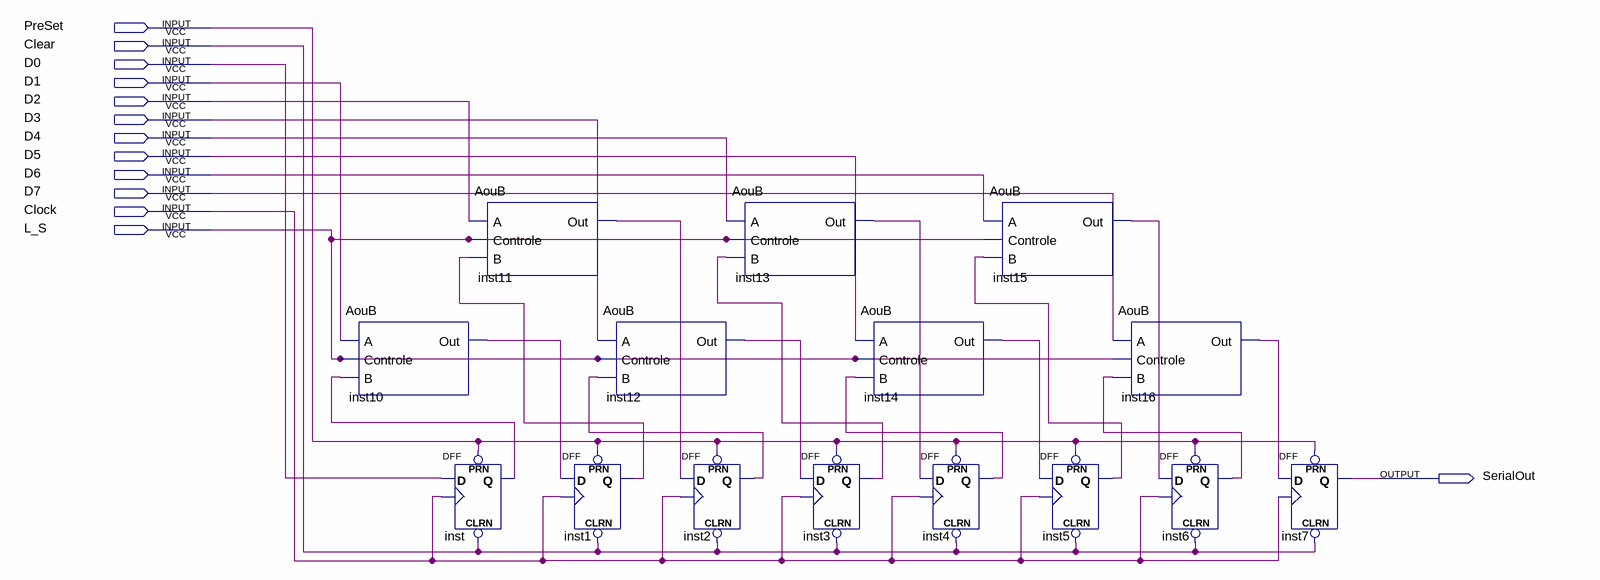
[diagram p0: schematic sheet]
// Quartus schematic PISO8.bdf as structural Verilog: 15 symbols, 13 pins
module PISO8 (
  input  PreSet,
  input  Clear,
  input  D0,
  input  D1,
  input  D2,
  input  D3,
  input  D4,
  input  D5,
  input  D6,
  input  D7,
  input  Clock,
  input  L_S,
  output SerialOut
);

  wire inst1_q, inst2_q, inst3_q, inst4_q, inst5_q, inst6_q, inst10_out, inst11_out, inst12_out, inst13_out,
       inst14_out, inst15_out, inst16_out, inst_q;

  AouB inst10 (.A(D1), .Controle(L_S), .B(inst_q), .Out(inst10_out));
  AouB inst11 (.A(D2), .Controle(L_S), .B(inst1_q), .Out(inst11_out));
  DFF inst (.CLRN(Clear), .CLK(Clock), .D(D0), .PRN(PreSet), .Q(inst_q));
  DFF inst1 (.CLRN(Clear), .CLK(Clock), .D(inst10_out), .PRN(PreSet), .Q(inst1_q));
  AouB inst12 (.A(D3), .Controle(L_S), .B(inst2_q), .Out(inst12_out));
  AouB inst13 (.A(D4), .Controle(L_S), .B(inst3_q), .Out(inst13_out));
  DFF inst2 (.CLRN(Clear), .CLK(Clock), .D(inst11_out), .PRN(PreSet), .Q(inst2_q));
  DFF inst3 (.CLRN(Clear), .CLK(Clock), .D(inst12_out), .PRN(PreSet), .Q(inst3_q));
  AouB inst14 (.A(D5), .Controle(L_S), .B(inst4_q), .Out(inst14_out));
  DFF inst4 (.CLRN(Clear), .CLK(Clock), .D(inst13_out), .PRN(PreSet), .Q(inst4_q));
  AouB inst15 (.A(D6), .Controle(L_S), .B(inst5_q), .Out(inst15_out));
  DFF inst5 (.CLRN(Clear), .CLK(Clock), .D(inst14_out), .PRN(PreSet), .Q(inst5_q));
  AouB inst16 (.A(D7), .Controle(L_S), .B(inst6_q), .Out(inst16_out));
  DFF inst6 (.CLRN(Clear), .CLK(Clock), .D(inst15_out), .PRN(PreSet), .Q(inst6_q));
  DFF inst7 (.CLRN(Clear), .CLK(Clock), .D(inst16_out), .PRN(PreSet), .Q(SerialOut));
endmodule
